# Altium project OBC.PrjPcb (part 1 of 2)
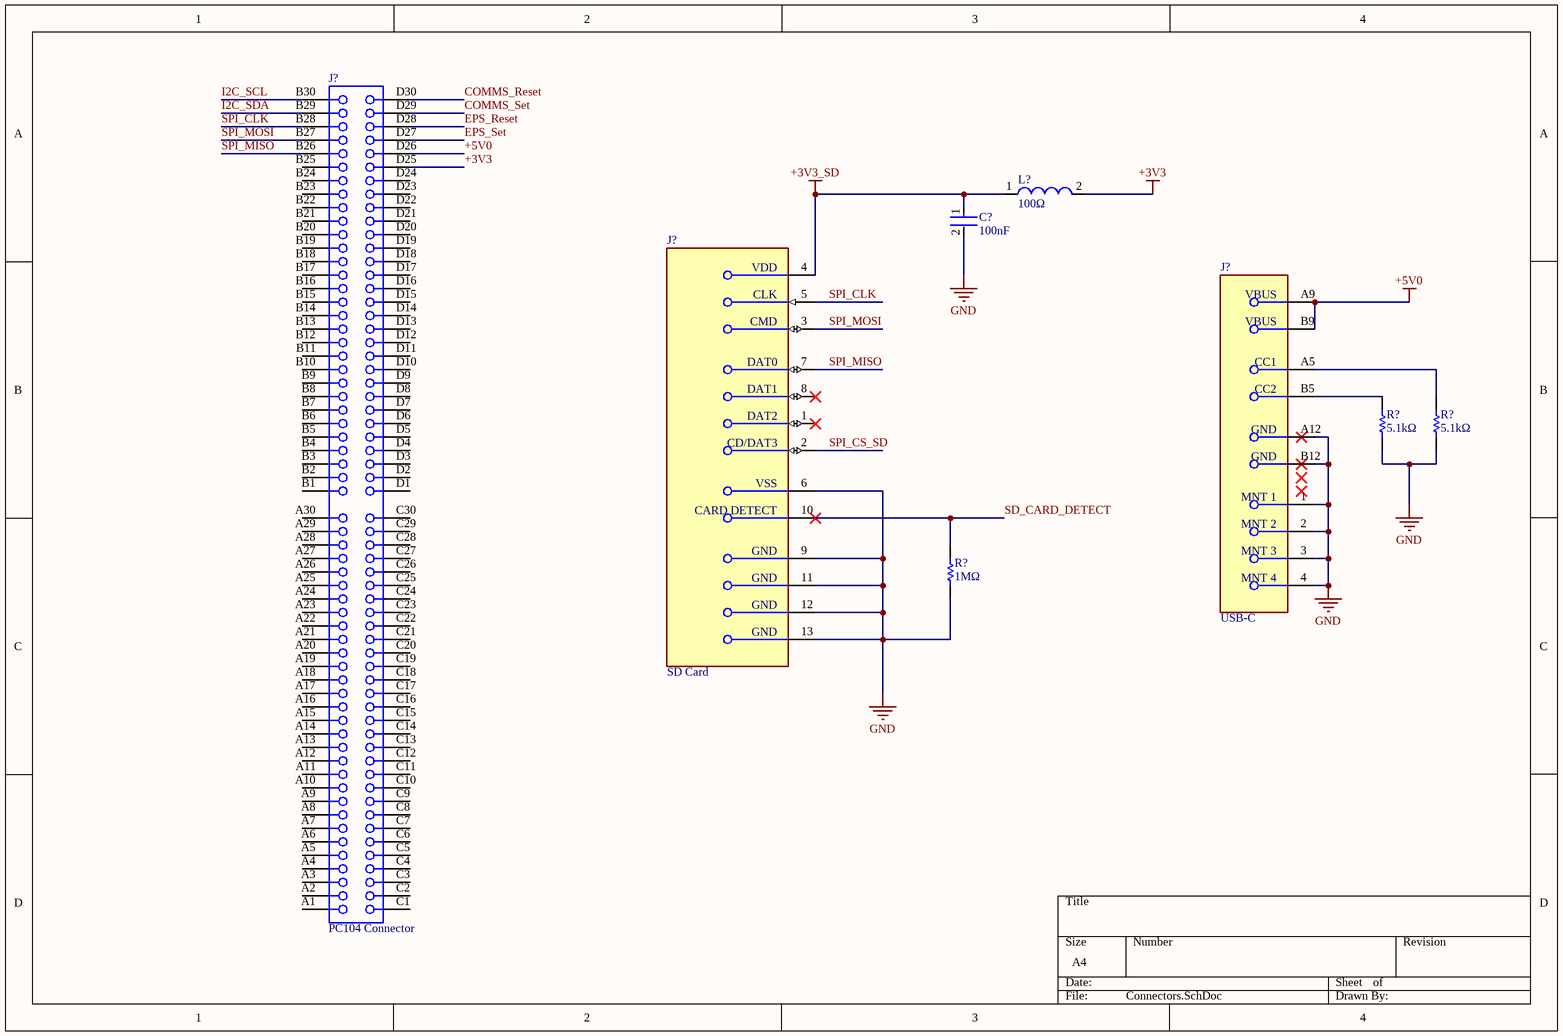
[diagram p0: Connectors.SchDoc]
CAGE_CODE: ?????; CONTRACT_NUMBER: <CONTRACT NO>; DOC_NO_ASSY_DWG: <ASSY DWG NO>; DOC_NO_BOM: <BOM DOC NO>; DOC_NO_FAB_DWG: <FAB DWG NO>; DOC_NO_SCH_DWG: <SCH DWG NO>; PCB_2_DEC_TOL: +/-.01; PCB_3_DEC_TOL: +/-.010; PCB_ANG_TOL: +/-1/2; PCB_ASSEMBLY_NO: <PCB ASSY NO>; PCB_CHECKER: - -----; PCB_CHECKER_APP_DATE: --/--/----; PCB_DESIGNER: - -----; PCB_DESIGNER_APP_DATE: --/--/----; PCB_DWG_NO: <PCB DWG NO>; PCB_ENGINEER: - -----; PCB_ENGINEER_APP_DATE: --/--/----; PCB_PART_NUMBER: <PCB PN>; PCB_REV: A; SCH_REV: A
8 sheets, 115 parts. Net scope: global (net labels, ports and power ports of the same name join across sheets).
Board file: PCB1.PcbDoc
Sheets:
  Connectors.SchDoc
  Sheet1.SchDoc
  Power.SchDoc
  Telemetry.SchDoc
  Microcontroller_Power.SchDoc
  Microcontroller_Interfacing.SchDoc
  Mounting_Holes.SchDoc
  Memory.SchDoc

## Sheet Connectors.SchDoc
size A4; SheetNumber: 1; SheetTotal: 7

### Parts
(Parts that share a designator on the sheet are numbered #1, #2 ... from top to bottom, then left to right.)
C?#1  100nF  [FP-CGA3E-0_3-0_1-IPC_A]
J?#1  SD Card  [FP-DM3CS-SF-MFG]
J?#2  USB-C  [FP-USB4125-GF-A-0190-MFG]
J?#3  PC104 Connector  [BTB2-V120F-04]
L?  100Ω  [SMD-0402]
R?#1  5.1kΩ  [RESC0603X26X15NL03T05]
R?#2  5.1kΩ  [RESC0603X26X15NL03T05]
R?#3  1MΩ  [RESC1005X40X25NL05T10]

### Nets
+3V3: J?#3.D25 L?.2
+3V3_SD: C?#1.1 J?#1.4(VDD) L?.1
+5V0: J?#2.A9(VBUS) J?#2.B9(VBUS) J?#3.D26
GND: C?#1.2 J?#1.6(VSS) J?#1.9(GND) J?#1.11(GND) J?#1.12(GND) J?#1.13(GND) J?#2.1(MNT_1) J?#2.2(MNT_2) J?#2.3(MNT_3) J?#2.4(MNT_4) J?#2.A12(GND) J?#2.B12(GND) R?#1.1 R?#2.1 R?#3.2
COMMS_Reset: J?#3.D30
COMMS_Set: J?#3.D29
EPS_Reset: J?#3.D28
EPS_Set: J?#3.D27
I2C_SCL: J?#3.B30
I2C_SDA: J?#3.B29
SD_CARD_DETECT: J?#1.10(CARD_DETECT) R?#3.1
SPI_CLK: J?#1.5(CLK) J?#3.B28
SPI_CS_SD: J?#1.2(CD/DAT3)
SPI_MISO: J?#1.7(DAT0) J?#3.B26
SPI_MOSI: J?#1.3(CMD) J?#3.B27
NetJ?#2_A5: J?#2.A5(CC1) R?#2.2
NetJ?#2_B5: J?#2.B5(CC2) R?#1.2

Not connected (* = marked no-connect by the designer): J?#1 1(DAT2)* 8(DAT1)*; J?#3 A1 A2 A3 A4 A5 A6 A7 A8 A9 A10 A11 A12 A13 A14 A15 A16 A17 A18 A19 A20 A21 A22 A23 A24 A25 A26 A27 A28 A29 A30 B1 B2 B3 B4 B5 B6 B7 B8 B9 B10 B11 B12 B13 B14 B15 B16 B17 B18 B19 B20 B21 B22 B23 B24 B25 C1 C2 C3 C4 C5 C6 C7 C8 C9 C10 C11 C12 C13 C14 C15 C16 C17 C18 C19 C20 C21 C22 C23 C24 C25 C26 C27 C28 C29 C30 D1 D2 D3 D4 D5 D6 D7 D8 D9 D10 D11 D12 D13 D14 D15 D16 D17 D18 D19 D20 D21 D22 D23 D24

### Library data of the parts
C?#1 = CMP-2000-07546-2: Cap Ceramic 100nF 50V X7R 10% Pad SMD 0603 +125°C Automotive T/R; Weight: 7.1E-05oz; Composition: Ceramic; Max Operating Temperature: 125°C; Termination: SMD/SMT; Dielectric: X7R; Length: 1.6mm; Package Quantity: 1; REACH SVHC: No SVHC; Lead Free: Lead Free; Case Code (Metric): 1608; Min Operating Temperature: -55°C; Packaging: Tape and Reel; Tolerance: 10%; Voltage Rating: 50V; Case Code (Imperial): 0603; Capacitance: 100nF; Case/Package: 0603; Voltage Rating (DC): 50V; Depth: 0.8mm; Radiation Hardening: No; Ratings: AEC-Q200; Mount: Surface Mount; Voltage: 50V; Thickness: 0.035inch; Width: 0.8mm; Height: 0.8mm
J?#1 = CMP-11597-000003-1: CONN MICRO SD CARD HINGED TYPE; Pitch: 1.1mm; Connector Type: Connector; Current Rating: 500mA; Voltage Rating (AC): 125V; Gender: Female; Insulation Resistance: 1GR; Number of Positions: 8; Contact Resistance: 100mR; Packaging: Tape and Reel; Flammability Rating: UL94 V-0; Lead Free: Lead Free; Min Operating Temperature: -25°C; Orientation: Right Angle; Width: 13.8mm; Number of Rows: 1; Housing Material: Polymer; Package Quantity: 1; Mount: Surface Mount; Max Current Rating: 500mA; Radiation Hardening: No; Max Operating Temperature: 85°C; Contact Plating: Gold; Depth: 1.83mm; Contact Material: Gold; Length: 14.1mm; Number of Contacts: 8; Termination: Solder
J?#2 = CMP-245163-000004-1: CONN RCPT TYPE C 6P SMD RA
J?#3 = CMP-0001-00103-1: Board-to-Board Connector, PCI104, Self-Nesting Socket, Stackthrough, Vertical, 4-Row, Pitch 2mm, 120-Position, Stack 15.24mm, Receptacle; Component Kind: Standard; ClassName: Board Template Connector; Package Reference: BTB2-V120F-04; Publisher: Altium
L? = CMP-0220-00104-1: SMD EMI Suppression Ferrite Bead WE-CBF, Z = 100 Ohm; Impedance: 100 Ohm; DatasheetVersion: ver 1, Jul-2009; PackageReference: SMD-0402; ComponentLink2URL: http://www.we-online.de/katalog/media/pdf/742792711.pdf; PackageVersion: 2009; PackageDescription: Chip Inductor, 2-Leads, Body 1.0 x 0.5 mm; ComponentLink1Description: Manufacturer Link; ComponentLink1URL: http://www.we-online.com; ComponentLink2Description: Datasheet
R?#1 R?#2 = CMP-2004-02525-1: Part Number: MCRE000157; Manufacturer: Multicomp
R?#3 = CMP-2002-07490-1: Manufacturer: Yageo / Phycomp; Part Number: RC0402FR-071ML

## Sheet Sheet1.SchDoc
size 431 x 279 mm; SheetNumber: 2; SheetTotal: 7; ENG_APP_DATE: --/--/--; DSN_APP_DATE: --/--/--; CHK_APP_DATE: --/--/--
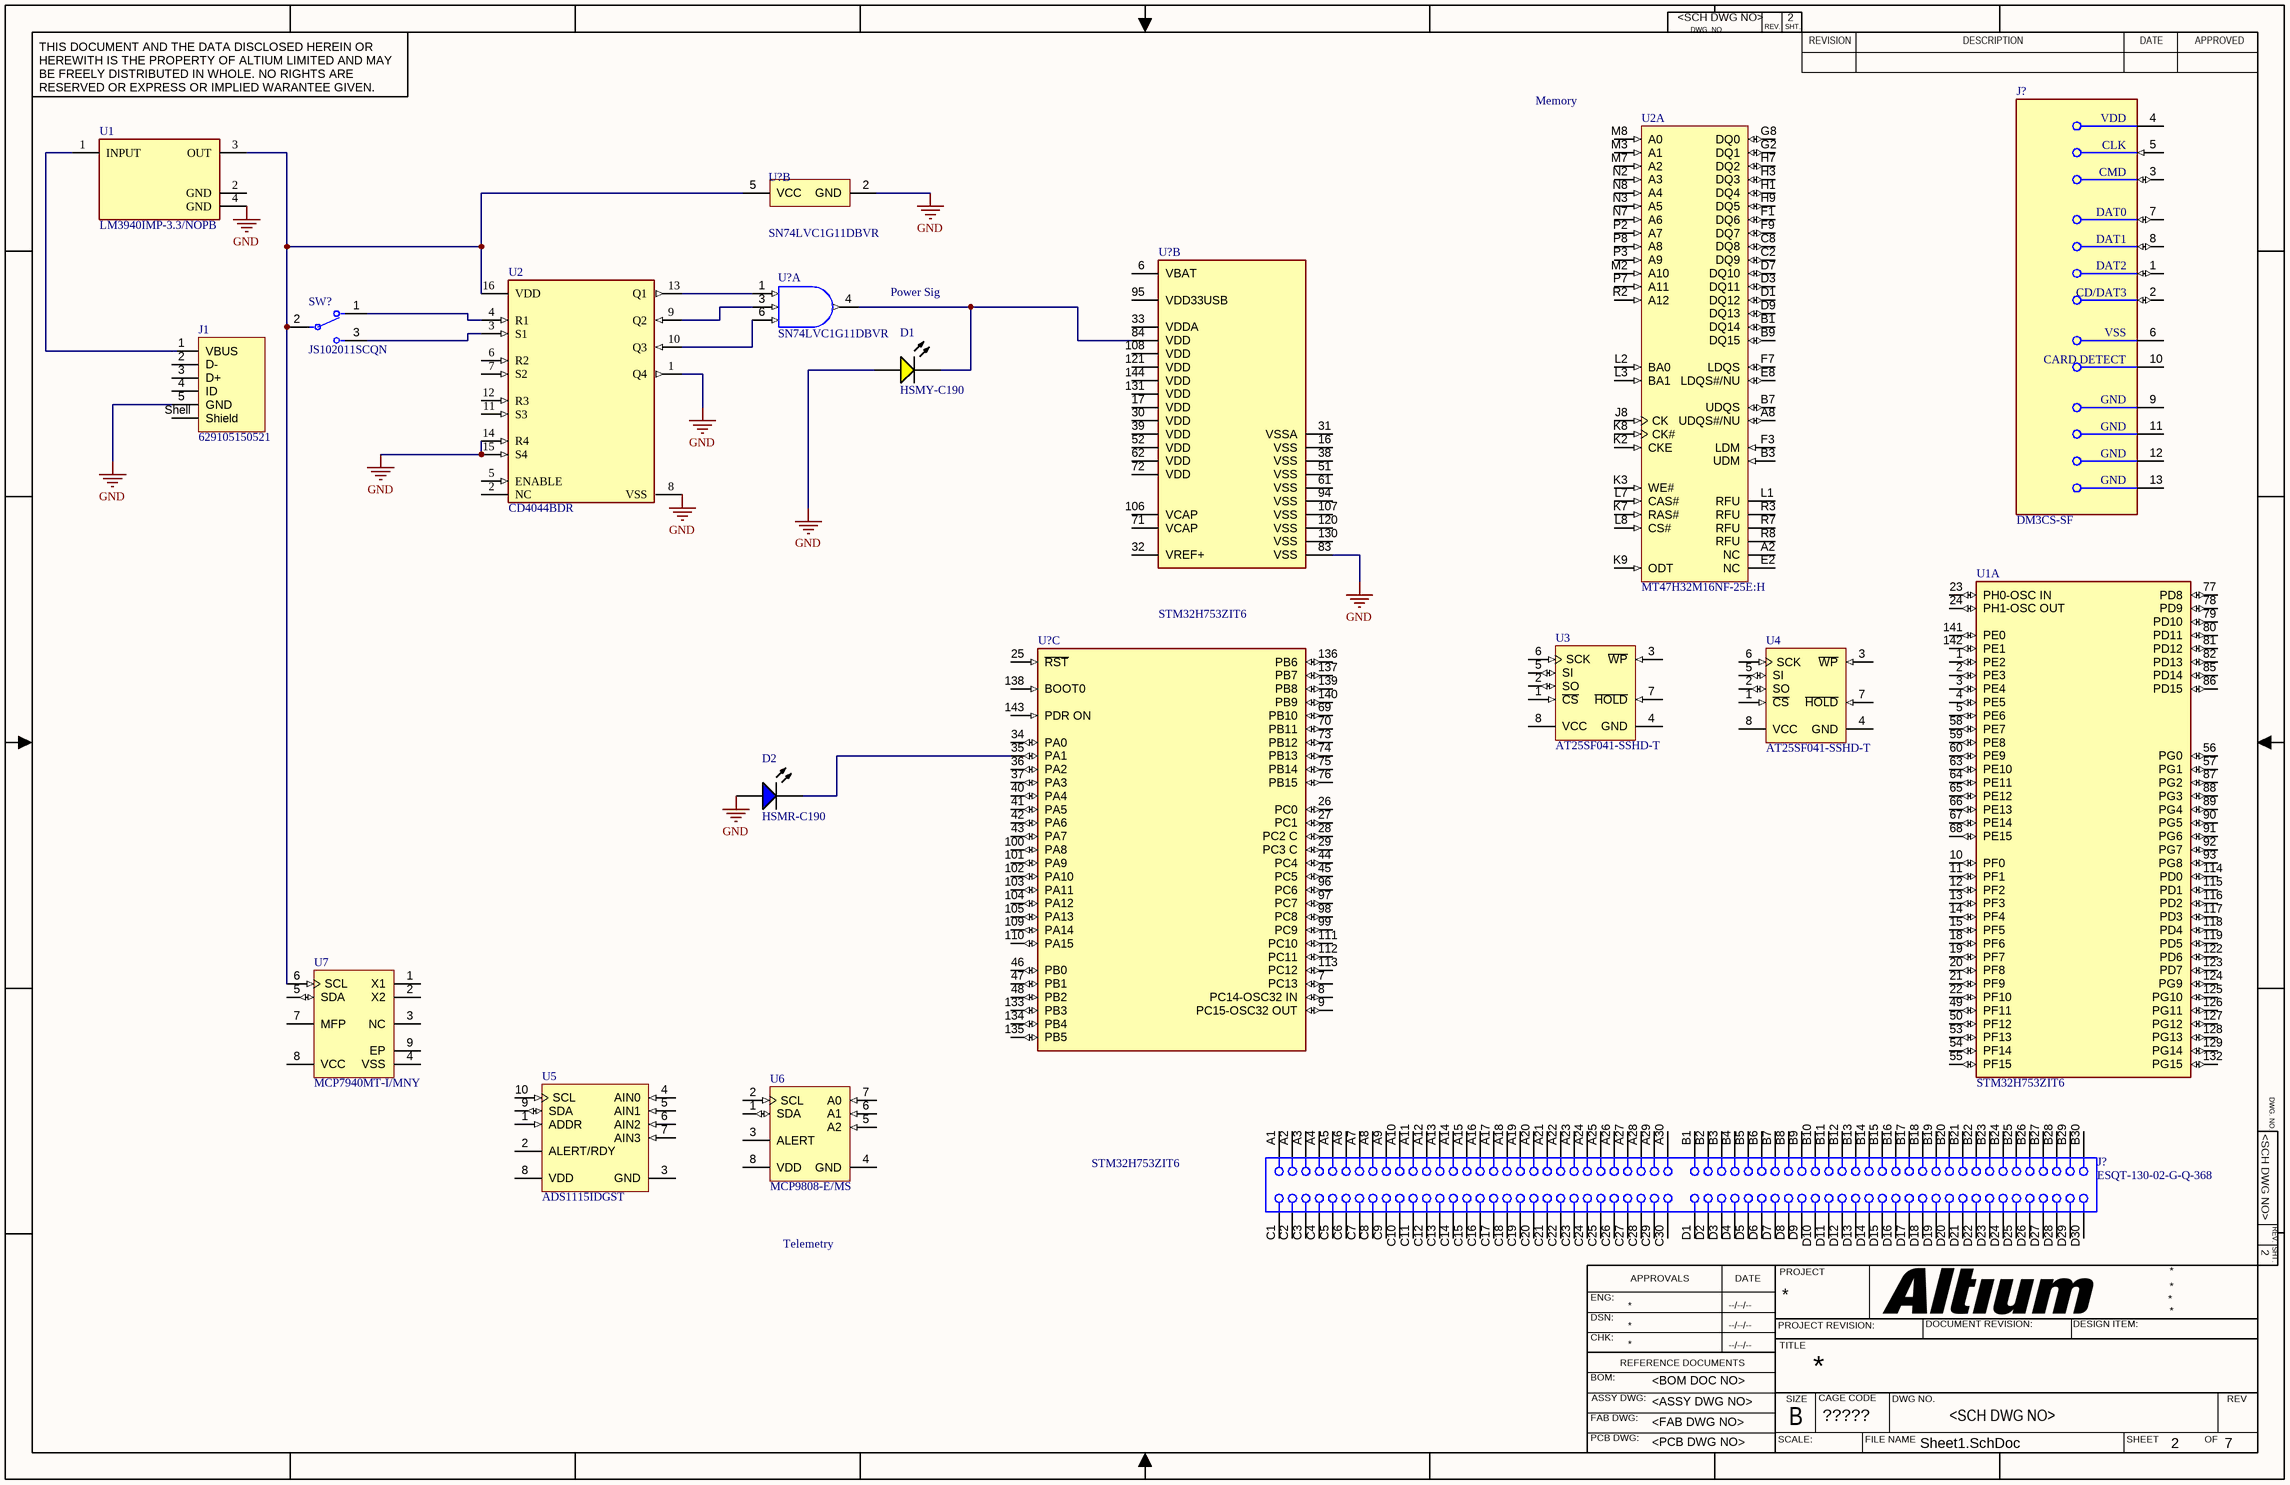
[diagram p1: Sheet1.SchDoc]

### Parts
(Parts that share a designator on the sheet are numbered #1, #2 ... from top to bottom, then left to right.)
D1  HSMY-C190  [AVAG-HSMX-C190_V]
D2  HSMR-C190  [AVAG-HSMX-C190_V]
J1  629105150521  [629105150521]
J?#4  DM3CS-SF  [FP-DM3CS-SF-MFG]
J?#5  ESQT-130-02-G-Q-368  [BTB2-V120F-04]
SW?#1  JS102011SCQN  [FP-JS102011SCQN-MFG]
U1#1  LM3940IMP-3.3/NOPB  [FP-DCY0004A-MFG]
U1#2  STM32H753ZIT6  [FP-LQFP144-1A-MFG]  (part A of 3)
U2#1  MT47H32M16NF-25E:H  [MICT-NF-84]  (part A of 2)
U2#2  CD4044BDR  [FP-D0016A-IPC_C]
U3  AT25SF041-SSHD-T  [ADST-SOIC-8_L]
U4  AT25SF041-SSHD-T  [ADST-SOIC-8_L]
U5  ADS1115IDGST  [TI-DGS10_M]
U6  MCP9808-E/MS  [MCHP-MSOP-MS8_L]
U7  MCP7940MT-I/MNY  [MCHP-TDFN-MNY8_V]
U?#1  SN74LVC1G11DBVR  [DBV0006A_N]  (part B of 2)
U?#2  STM32H753ZIT6  [FP-LQFP144-1A-MFG]  (part B of 3)
U?#3  SN74LVC1G11DBVR  [DBV0006A_N]  (part A of 2)
U?#4  STM32H753ZIT6  [FP-LQFP144-1A-MFG]  (part C of 3)

### Nets
GND: D1.1(A) D2.1(A) J1.5(GND) U1#1.4(GND) U2#2.1(Q4) U2#2.8(VSS) U2#2.14(R4) U2#2.15(S4) U?#1.2(GND) U?#2.83(VSS)
NetD1_2: D1.2(K) U?#2.84(VDD) U?#3.4(Y)
NetD2_2: D2.2(K) U?#4.35(PA1)
NetJ1_1: J1.1(VBUS) U1#1.1(INPUT)
NetSW?#1_1: SW?#1.1 U2#2.4(R1)
NetSW?#1_2: SW?#1.2(C) U1#1.3(OUT) U2#2.16(VDD) U7.6(SCL) U?#1.5(VCC)
NetSW?#1_3: SW?#1.3 U2#2.3(S1)
NetU2#2_9: U2#2.9(Q2) U?#3.3(B)
NetU2#2_10: U2#2.10(Q3) U?#3.6(C)
NetU2#2_13: U2#2.13(Q1) U?#3.1(A)

Not connected (* = marked no-connect by the designer): J1 2(D-) 3(D+) 4(ID) Shell(Shield); J?#4 1(DAT2) 2(CD/DAT3) 3(CMD) 4(VDD) 5(CLK) 6(VSS) 7(DAT0) 8(DAT1) 9(GND) 10(CARD_DETECT) 11(GND) 12(GND) 13(GND); J?#5 A1 A2 A3 A4 A5 A6 A7 A8 A9 A10 A11 A12 A13 A14 A15 A16 A17 A18 A19 A20 A21 A22 A23 A24 A25 A26 A27 A28 A29 A30 B1 B2 B3 B4 B5 B6 B7 B8 B9 B10 B11 B12 B13 B14 B15 B16 B17 B18 B19 B20 B21 B22 B23 B24 B25 B26 B27 B28 B29 B30 C1 C2 C3 C4 C5 C6 C7 C8 C9 C10 C11 C12 C13 C14 C15 C16 C17 C18 C19 C20 C21 C22 C23 C24 C25 C26 C27 C28 C29 C30 D1 D2 D3 D4 D5 D6 D7 D8 D9 D10 D11 D12 D13 D14 D15 D16 D17 D18 D19 D20 D21 D22 D23 D24 D25 D26 D27 D28 D29 D30; U1#1 2(GND); U1#2 1(PE2) 2(PE3) 3(PE4) 4(PE5) 5(PE6) 10(PF0) 11(PF1) 12(PF2) 13(PF3) 14(PF4) 15(PF5) 18(PF6) 19(PF7) 20(PF8) 21(PF9) 22(PF10) 23(PH0-OSC_IN) 24(PH1-OSC_OUT) 49(PF11) 50(PF12) 53(PF13) 54(PF14) 55(PF15) 56(PG0) 57(PG1) 58(PE7) 59(PE8) 60(PE9) 63(PE10) 64(PE11) 65(PE12) 66(PE13) 67(PE14) 68(PE15) 77(PD8) 78(PD9) 79(PD10) 80(PD11) 81(PD12) 82(PD13) 85(PD14) 86(PD15) 87(PG2) 88(PG3) 89(PG4) 90(PG5) 91(PG6) 92(PG7) 93(PG8) 114(PD0) 115(PD1) 116(PD2) 117(PD3) 118(PD4) 119(PD5) 122(PD6) 123(PD7) 124(PG9) 125(PG10) 126(PG11) 127(PG12) 128(PG13) 129(PG14) 132(PG15) 141(PE0) 142(PE1); U2#1 A2(NC) A8(UDQS#/NU) B1(DQ14) B3(UDM) B7(UDQS) B9(DQ15) C2(DQ9) C8(DQ8) D1(DQ12) D3(DQ11) D7(DQ10) D9(DQ13) E2(NC) E8(LDQS#/NU) F1(DQ6) F3(LDM) F7(LDQS) F9(DQ7) G2(DQ1) G8(DQ0) H1(DQ4) H3(DQ3) H7(DQ2) H9(DQ5) J8(CK) K2(CKE) K3(WE#) K7(RAS#) K8(CK#) K9(ODT) L1(RFU) L2(BA0) L3(BA1) L7(CAS#) L8(CS#) M2(A10) M3(A1) M7(A2) M8(A0) N2(A3) N3(A5) N7(A6) N8(A4) P2(A7) P3(A9) P7(A11) P8(A8) R2(A12) R3(RFU) R7(RFU) R8(RFU); U2#2 2(NC) 5(ENABLE) 6(R2) 7(S2) 11(S3) 12(R3); U3 1(~{CS}) 2(SO) 3(~{WP}) 4(GND) 5(SI) 6(SCK) 7(~{HOLD}) 8(VCC); U4 1(~{CS}) 2(SO) 3(~{WP}) 4(GND) 5(SI) 6(SCK) 7(~{HOLD}) 8(VCC); U5 1(ADDR) 2(ALERT/RDY) 3(GND) 4(AIN0) 5(AIN1) 6(AIN2) 7(AIN3) 8(VDD) 9(SDA) 10(SCL); U6 1(SDA) 2(SCL) 3(ALERT) 4(GND) 5(A2) 6(A1) 7(A0) 8(VDD); U7 1(X1) 2(X2) 3(NC) 4(VSS) 5(SDA) 7(MFP) 8(VCC) 9(EP); U?#2 6(VBAT) 16(VSS) 17(VDD) 30(VDD) 31(VSSA) 32(VREF+) 33(VDDA) 38(VSS) 39(VDD) 51(VSS) 52(VDD) 61(VSS) 62(VDD) 71(VCAP) 72(VDD) 94(VSS) 95(VDD33USB) 106(VCAP) 107(VSS) 108(VDD) 120(VSS) 121(VDD) 130(VSS) 131(VDD) 144(VDD); U?#4 7(PC13) 8(PC14-OSC32_IN) 9(PC15-OSC32_OUT) 25(~{RST}) 26(PC0) 27(PC1) 28(PC2_C) 29(PC3_C) 34(PA0) 36(PA2) 37(PA3) 40(PA4) 41(PA5) 42(PA6) 43(PA7) 44(PC4) 45(PC5) 46(PB0) 47(PB1) 48(PB2) 69(PB10) 70(PB11) 73(PB12) 74(PB13) 75(PB14) 76(PB15) 96(PC6) 97(PC7) 98(PC8) 99(PC9) 100(PA8) 101(PA9) 102(PA10) 103(PA11) 104(PA12) 105(PA13) 109(PA14) 110(PA15) 111(PC10) 112(PC11) 113(PC12) 133(PB3) 134(PB4) 135(PB5) 136(PB6) 137(PB7) 138(BOOT0) 139(PB8) 140(PB9) 143(PDR_ON)

### Notes on the sheet
- Memory
- Power Sig
- Telemetry
- DWG. NO.
- REV.
- SHT.
- THIS DOCUMENT AND THE DATA DISCLOSED HEREIN OR HEREWITH IS THE PROPERTY OF ALTIUM LIMITED AND MAY BE FREELY DISTRIBUTED IN WHOLE. NO RIGHTS ARE RESERVED OR EXPRESS OR IMPLIED WARANTEE GIVEN.
- REVISION
- DESCRIPTION
- DATE
- APPROVED
- ENG:
- APPROVALS
- PROJECT
- DSN:
- CHK:
- REFERENCE DOCUMENTS
- PROJECT REVISION:
- TITLE
- DOCUMENT REVISION:
- DESIGN ITEM:
- BOM:
- FAB DWG:
- PCB DWG:
- ASSY DWG:
- SCALE:
- SIZE
- B
- CAGE CODE
- FILE NAME
- DWG NO.
- SHEET
- OF
- REV

### Library data of the parts
D1 = CMP-1744-00003-1: LED Uni-Color Yellow, 65 mW, 20 mA, -40 to 85 degC, 2-Pin SMD, RoHS, Tape and Reel; Tolerance: 1%; Voltage Rating: 50 V; Power Rating: 100 mW; Case\Package: 0603; Resistance: 390 Ohm; Min Operating Temperature: -55 degC; Length: 1.6 mm; ComponentLink3Description: Package Specification; Mount: Surface Mount; PackageReference: HSMX-C190; ComponentLink2Description: Datasheet; DatasheetVersion: Mar-12; Case Code (Metric): 1608; Pins: 2; Package Quantity: 5000; ComponentLink2URL: http://docs.avagotech.com/docs/AV02-0551EN; ComponentLink1Description: Manufacturer URL; RoHSCompliant: true; Packaging: Tape and Reel; PackageDescription: 2-Pin Surface Mount Device, Body 1.6 x 0.8 mm, Height 0.9 mm; REACH SVHC: No SVHC; ComponentLink3URL: http://www.fairchildsemi.com/dwg/MA/MA03D.pdf; Voltage Rating (DC): 50 V; Width: 0.8 mm; ComponentLink1URL: http://www.avagotech.com/; Max Operating Temperature: 155 degC; Case Code (Imperial): 0603; Height: 0.45 mm
D2 = CMP-1744-00007-1: LED Uni-Color Blue, 78 mW, 20 mA, -40 to 85 degC, 2-Pin SMD, RoHS, Tape and Reel; Rds On Max: 10 Ohm; Nominal Vgs: -1.7 V; Max Power Dissipation: 360 mW; Elements: 1; Case\Package: TO-236-3; Input Capacitance: 73 pF; Typical Rise Time: 6.3 ns; Nominal Dual Supply Voltage: -50 V; Packaging: Tape and Reel; Height: 0.93 mm; Mount: Surface Mount; RoHSCompliant: true; DatasheetVersion: Apr-10; REACH SVHC: No SVHC; ComponentLink1URL: http://www.avagotech.com/; Radiation Hardening: No; ComponentLink3Description: Package Specification; ComponentLink3URL: http://www.fairchildsemi.com/dwg/MA/MA03D.pdf; ComponentLink2Description: Datasheet; PackageDescription: 2-Pin Surface Mount Device, Body 1.6 x 0.8 mm, Height 0.9 mm; Package Quantity: 3000; PackageReference: HSMX-C190; ComponentLink1Description: Manufacturer URL; Pins: 3; Length: 2.92 mm; ComponentLink2URL: http://docs.avagotech.com/docs/AV02-0977EN; Min Operating Temperature: -55 degC; Width: 1.3 mm; Max Operating Temperature: 150 degC
J1 = CMP-1502-03252-3: NexarPartId: 52645113; Number of Contacts: 5; Contact Resistance: 30mΩ; Connector Type: USB; Voltage Rating: 30V; Current Rating: 3A; USB Standard: USB 2.0; Gender: Receptacle; Insulation Resistance: 1GΩ; Height: 2.86mm; REACH SVHC: Unknown; RoHS: Compliant; Features: Shielded; Termination: SMD/SMT; Number of Pins: 5; Contact Plating: Gold; Packaging: Tape and Reel; Contact Material: Gold; Mount: Horizontal, Surface Mount; Max Operating Temperature: 85°C; Lead Free: Lead Free; Min Operating Temperature: -40°C; Orientation: Horizontal; Operating Supply Voltage: 30V
J?#4 = CMP-11597-000003-1: as J?#1 on sheet Connectors; Packaging: Tape and Reel; Flammability Rating: UL94 V-0; Lead Free: Lead Free; Min Operating Temperature: -25°C; Orientation: Right Angle; Width: 13.8mm; Number of Rows: 1; Housing Material: Polymer; Package Quantity: 1; Mount: Surface Mount; Max Current Rating: 500mA; Radiation Hardening: No; Max Operating Temperature: 85°C; Contact Plating: Gold; Depth: 1.83mm; Contact Material: Gold; Length: 14.1mm; Number of Contacts: 8; Termination: Solder
J?#5 = CMP-0001-00103-1: as J?#3 on sheet Connectors; Component Kind: Standard; ClassName: Board Template Connector; Package Reference: BTB2-V120F-04; Publisher: Altium
SW?#1 = CMP-10038-000023-1: SWITCH SLIDE SPDT 300MA 6V; Electrical Life: 5000Cycles; Actuator Type: Standard; Contact Resistance: 70mR; Actuator Material: Nylon; Max Voltage Rating (DC): 30V; Actuator Length: 2mm; Switch Function: On-On; Actuator Color: Black; Radiation Hardening: No; Throw Configuration: SPDT; Depth: 7.5mm; Case/Package: SMD/SMT; Package Quantity: 4000; Min Operating Temperature: -40°C; Length: 8.5mm; Current Rating: 300mA; Mount: Surface Mount; Voltage Rating (DC): 6V; RoHS Compliant: Yes; Orientation: Straight; Housing Material: Nylon; Contact Plating: Silver; Max Operating Temperature: 85°C; Packaging: Tape and Reel; Switch Travel: 2mm; Max Current Rating: 300mA; Contact Material: Copper Alloy; Series: JS; Termination: Gull Wing
U1#1 = CMP-0062-01788-4: IC REG LINEAR 3.3V 1A SOT223-4; Min Input Voltage: 4.5V; Max Supply Voltage: 7.5V; Number of Outputs: 1; Output Type: Fixed; Polarity: Positive; Dropout Voltage: 500mV; Quiescent Current: 15mA; Max Output Voltage: 3.3V; Length: 6.5mm; Termination: SMD/SMT; Width: 3.56mm; Min Supply Voltage: 4.5V; Max Output Current: 1A; Case/Package: SOT-223; Output Voltage: 3.3V; Current Rating: 1A; Packaging: Tape and Reel; Lead Free: Lead Free; Nominal Output Voltage: 3.3V; Height: 1.6mm; Series: -; Output Configuration: Positive; Radiation Hardening: No; Number of Regulators: 1; Package Quantity: 1000; REACH SVHC: No SVHC; Max Input Voltage: 7.5V; Max Operating Temperature: 125°C; Min Operating Temperature: -40°C; Output Current: 1A; Contact Plating: Tin; Number of Pins: 4; Mount: Surface Mount
U1#2 U?#2 U?#4 = CMP-12105-000009-1: LQFP 144 20X20X1.4 2; Manufacturer: STMicroelectronics; Number Of Pwm Channels: 24; Number Of I/Os: 114; Number Of Cores: 1; Min Supply Voltage: 1.62V; Interface: I2C,SPI,UART,USART,CAN,USB,LIN,IrDA,Ethernet,I2S,SMBus,Other; Standoff Height: 0.05mm; Number Of I2C Channels: 4; Max Junction Temp: +125°C; Memory Type: FLASH; Ram Size: 1MBytes; Number Of Spi Channels: 6; Core Architecture: ARM Cortex-M7; Number Of Uart Channels: 9; Memory Size: 2MBytes; Number Of Adc Channels: 36; Frequency: 480MHz; Data Bus Width: 32bits; Max Supply Voltage: 3.6V; Number Of Usb Channels: 2; Number Of A/D Converters: 3; Number Of Timers/Counters: 20; Temperature Range High: +125°C; Automotive: No; Mouser Description: MCU 32-Bit STM32 ARM Cortex M7 RISC 2MB Flash 1.8V/2.5V/3.3V 144-Pin LQFP Tray; Device Class L3: Microcontrollers; Height: 1.6mm; Octopart: https://octopart.com/stm32h753zit6-stmicroelectronics-87879771; Device Class L2: Embedded Processors and Controllers; Lead Free: Yes; Category: IC; ComponentLink2URL: https://www.st.com/resource/en/datasheet/stm32h753zi.pdf; Ambient Temperature Range High: +85°C; Number Of Ethernet Channels: 1; Device Class L1: Integrated Circuits (ICs); Ambient Temperature Range Low: -40°C; Package: LQFP144-1A; Temperature Range Low: -40°C; Digikey Description: LQFP 144 20X20X1.4 2; ComponentLink2Description: Datasheet; Temperature: -40°C to +125°C; Manufacturer Part Number: STM32H753ZIT6; RoHS: TRUE
U2#1 = CMP-2000-05228-1: 512 Mb DDR2-800 SDRAM, 32 Mb x 16, 2.5 ns, 1.8 V, 0 to 85 degC, 84-Ball FBGA, RoHS, Bulk; Manufacturer: Micron; Density: 512Mb; Number of I/O Lines: 16Bit; Maximum Clock Rate: 400MHz; Maximum Random Access Time: 0.4ns; Organization: 32Mx16; Screening Level: Commercial; Address Bus Width: 13Bit; Operating Supply Voltage: 1.8V; Lead Finish: Tin; Max Processing Temp: 260; Package Description: 84-Ball Ball Grid Array, Body 12.5 x 8 mm, Pitch 0.8 mm; Mounting: SurfaceMount; Datasheet URL: https://ciiva.com/datasheet-click-29613630?src=ciiva&sig=42c75271; Package Reference: NF84; Number of Bits per Word: 16Bit; Datasheet Version: Rev. W, 04/2014; Operating Temperature: 0to85C; Manufacturer URL: https://www.micron.com/; Type: DDR2SDRAM; Data Bus Width: 16Bit
U2#2 = CMP-04902-000018-1: IC QUAD NAND R/S LATCH 16SOIC; Polarity: Non-Inverting; Min Supply Voltage: 3V; Number of Output Lines: 4; Output Type: 3-STATE; Max Supply Voltage: 18V; Turn-On Delay Time: 50ns; Number of Elements: 1; Number of Input Lines: 8; Output Current: 6.8mA; High Level Output Current: -4.2mA; Low Level Output Current: 4.2mA; Quiescent Current: 20uA; Propagation Delay: 300ns; Mount: Surface Mount; Packaging: Tape and Reel; Weight: 0.004998oz; Contact Plating: Gold; Independent Circuits: 4; Number of Pins: 16; Number of Bits: 4; Max Operating Temperature: 125°C; Radiation Hardening: No; Case/Package: SOIC; Number of Circuits: 1; Technology: CMOS; Min Operating Temperature: -55°C; Package Quantity: 1; Lead Free: Lead Free; RoHS Compliant: Yes; Logic Function: Latch; Series: 4000B
U3 U4 = CMP-2000-07560-1: SPI Serial Flash Memory with Dual-I/O and Quad-I/O Support, 4 Mbits, 2.5 to 3.6 V, -40 to 85 degC, 8-Pin SOIC, RoHS, Tape and Reel; Manufacturer: Adesto; Frequency: 104MHz; Access Time: 8ns; Data Bus Width: 8b; Min Supply Voltage: 2.5V; Operating Supply Voltage: 3.3V; Package Version: Rev. G, 08/2014; Density: 4Mb; Page Size: 256B; Max Supply Voltage: 3.6V; Max Supply Current: 8mA; Number of Pins: 8; Memory Type: FLASH; Manufacturer URL: http://www.adestotech.com/; Max Frequency: 104MHz; Interface: Serial; Package Quantity: 4000; Weight: 0.019048oz; Mounting Technology: SurfaceMount; Min Operating Temperature: -40degC; Package Reference: SOIC-8; Max Operating Temperature: 85degC; Lead Free: LeadFree; Mount: SurfaceMount; Contact Plating: Gold; RoHSCompliant: True; Package Description: 8-Pin Small Outline Integrated Circuit, Body 4.925 x 3.9 mm, Pitch 1.27 mm; Case\/Package: SOIC; Datasheet URL: http://www.adestotech.com/wp-content/uploads/DS-AT25SF041_044.pdf; Datasheet Version: Rev. G, 08/2017; Memory Size: 4Mb; Packaging: TapeandReel
U5 = CMP-0003-00378-2: 16-Bit ADC with Integrated Multiplexer, PGA, Comparator, Oscillator, and Reference, -40 to 125 degC, 10-pin SOP (DGS10), Green (RoHS & no Sb/Br); Manufacturer: Texas Instruments; Sample Rate (max)(SPS): 860; SubFamily: Precision ADC (<=10MSPS); Architecture: Delta-Sigma; Digital Supply(Min)(V): 2; Resolution(Bits): 16; Digital Supply(Max)(V): 5.5; INL(Max)(+/-LSB): 1; Interface: Serial I2C; # Input Channels: 4; Eco-Plan: Green (RoHS & no Sb/Br); PackageDescription: 10-Pin Plastic Small Outline, Body 3 x 3 mm, Pitch 0.5 mm; Mounting Technology: Surface Mount; PackageReference: DGS10; DatasheetVersion: SBAS444B; ComponentLink3Description: Package Specification; ComponentLink1Description: Manufacturer URL; PartNumber: ADS1115IDGST; ComponentLink3URL: http://www.ti.com/lit/ml/mpds035b/mpds035b.pdf; ComponentLink2URL: http://www.ti.com/general/docs/lit/getliterature.tsp?genericPartNumber=ADS1115&fileType=pdf; Analog Voltage AV/DD(Min)(V): 2; ComponentLink2Description: Datasheet; PackageVersion: 4073272/C, 02/2004; Analog Voltage AV/DD(Max)(V): 5.5; Code_JEDEC: MO-153; ComponentLink1URL: http://www.ti.com/
U6 = CMP-0192-00344-1: + / - 0.5 degC Maximum Accuracy Digital Temperature Sensor, 400 uA, 2.7 to 5.5 V, -40 to 125 degC, 8-pin MSOP (MS8), Tube; Manufacturer: Microchip; ComponentLink3Description: Package Specification; ComponentLink4URL: http://www.microchip.com/MCP9808; PackageDescription: 8-Lead Plastic Micro Small Outline Package, 3 x 3 mm Body, 0.65 mm Pitch; ComponentLink2Description: Datasheet; PartNumber: MCP9808-E/MS; Mounting Technology: Surface Mount; ComponentLink4Description: Product URL; ComponentLink1Description: Manufacturer URL; ComponentLink2URL: http://ww1.microchip.com/downloads/en/DeviceDoc/25095A.pdf; ComponentLink3URL: http://www.microchip.com/stellent/groups/techpub_sg/documents/packagingspec/en012702.pdf; DatasheetVersion: Rev. A; ComponentLink1URL: http://www.microchip.com; PackageReference: MSOP-MS8; PackageVersion: C04-111C
U7 = CMP-0186-00324-1: Low-Cost I2C™ Real-Time Clock / Calendar with SRAM, 400 KHz Communications Speed, 64 Bytes SRAM, -40 to 85 degC, 8-pin TDFN (MNY8), Tape and Reel; Manufacturer: Microchip; ComponentLink2URL: http://ww1.microchip.com/downloads/en/DeviceDoc/22292A.pdf; ComponentLink3Description: Package Specification; Mounting Technology: Surface Mount; PackageVersion: C04-129C; ComponentLink4URL: http://www.microchip.com/MCP7940M; DatasheetVersion: Rev. A; PackageReference: TDFN-MNY8; PartNumber: MCP7940MT-I/MNY; ComponentLink4Description: Product URL; ComponentLink2Description: Datasheet; ComponentLink3URL: http://www.microchip.com/stellent/groups/techpub_sg/documents/packagingspec/en012702.pdf; PackageDescription: 8-Lead Plastic Dual Flat, 2 x 3 mm Body, 0.5 mm Pitch; ComponentLink1Description: Manufacturer URL; ComponentLink1URL: http://www.microchip.com
U?#1 U?#3 = CMP-0859-00236-3: Single 3-Input Positive-AND Gate, DBV0006A, LARGE T&R; Manufacturer: Texas Instruments; Output Type: CMOS; Voltage(Nom)(V): 1.8,2.5,3.3,5; ICC @ Nom Voltage(Max)(mA): 0.01; VCC(Min)(V): 1.65; Output Drive (IOL/IOH)(Max)(mA): 32/-32; Schmitt Trigger: No; Input Type: CMOS/TTL; VCC(Max)(V): 5.5; Gate Type: AND; Rating: Catalog; tpd @ Nom Voltage(Max)(ns): 20,7.8,6.2,4.6; Bits(#): 1; F @ Nom Voltage(Max)(Mhz): 150; Logic: True; Technology Family: LVC; Sub-Family: AND Gate; PackageReference: DBV0006A; Operating Temperature Range(C): -40 to 125,-40 to 85; DatasheetVersion: SCES487F; 3-State Output: No; Generic Part Number: SN74LVC1G11

## Sheet Power.SchDoc
size A4; SheetNumber: 3; SheetTotal: 7
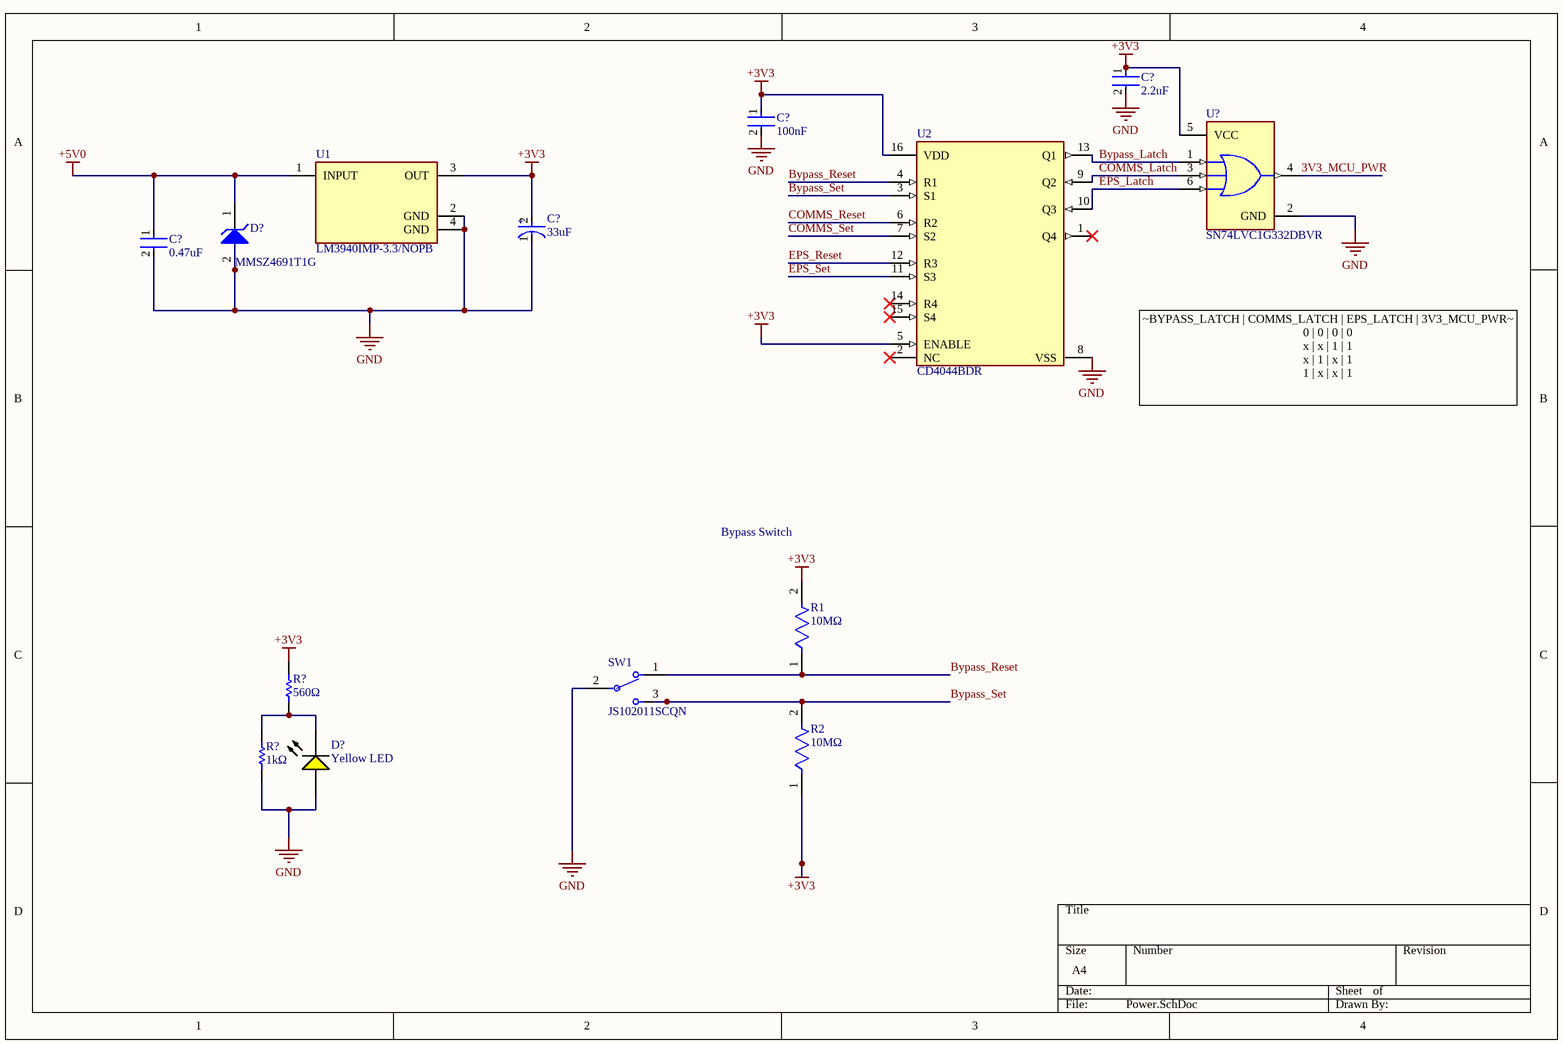
[diagram p2: Power.SchDoc]

### Parts
(Parts that share a designator on the sheet are numbered #1, #2 ... from top to bottom, then left to right.)
C?#2  2.2uF  [FP-GRM188-0_1-e0_2_0_5-MFG]
C?#3  100nF  [FP-CGA3E-0_3-0_1-IPC_A]
C?#4  33uF  [FP-TPSD-MFG]
C?#5  0.47uF  [FP-GRM188-0_1-e0_2_0_5-IPC_B]
D?#1  MMSZ4691T1G  [ONSC-SOD-123-2-425-04_V]
D?#2  Yellow LED  [AVAG-HSMX-C190_V]
R1  10MΩ  [FP-ERJ3EK-IPC_C]
R2  10MΩ  [FP-ERJ3EK-IPC_C]
R?#4  560Ω  [RESC1608X55X30ML15T15]
R?#5  1kΩ  [RESC2013X60X35ML10T20]
SW1  JS102011SCQN  [FP-JS102011SCQN-MFG]
U1#3  LM3940IMP-3.3/NOPB  [FP-DCY0004A-MFG]
U2#3  CD4044BDR  [FP-D0016A-IPC_C]
U?#5  SN74LVC1G332DBVR  [FP-DBV0006A-MFG]

### Nets
+3V3: C?#2.1 C?#3.1 C?#4.2(A) R1.2 R2.1 R?#4.2 U1#3.3(OUT) U2#3.5(ENABLE) U2#3.16(VDD) U?#5.5(VCC)
+5V0: C?#5.1 D?#1.1(K) U1#3.1(INPUT)
GND: C?#2.2 C?#3.2 C?#4.1(C) C?#5.2 D?#1.2(A) D?#2.1(A) R?#5.1 SW1.2(C) U1#3.2(GND) U1#3.4(GND) U2#3.8(VSS) U?#5.2(GND)
3V3_MCU_PWR: U?#5.4(Y)
Bypass_Latch: U2#3.13(Q1) U?#5.1(A)
Bypass_Reset: R1.1 SW1.1 U2#3.4(R1)
Bypass_Set: R2.2 SW1.3 U2#3.3(S1)
COMMS_Latch: U2#3.9(Q2) U?#5.3(B)
COMMS_Reset: U2#3.6(R2)
COMMS_Set: U2#3.7(S2)
EPS_Latch: U2#3.10(Q3) U?#5.6(C)
EPS_Reset: U2#3.12(R3)
EPS_Set: U2#3.11(S3)
NetD?#2_2: D?#2.2(K) R?#4.1 R?#5.2

Not connected (* = marked no-connect by the designer): U2#3 1(Q4)* 2(NC)* 14(R4)* 15(S4)*

### Notes on the sheet
- ~BYPASS_LATCH | COMMS_LATCH | EPS_LATCH | 3V3_MCU_PWR~
  0 | 0 | 0 | 0
  x | x | 1 | 1
  x | 1 | x | 1
  1 | x | x | 1
- Bypass Switch
- (in symbol CMP-2000-07304-2) +

### Library data of the parts
C?#2 = CMP-2006-02836-2: Chip Multilayer Ceramic Capacitors for General Purpose, 0603, 2.2uF, X7R, 15%, 10%, 10V; Case Code (Metric): 1608; Height: 0.8mm; Packaging: Cut Tape; Voltage: 10V; Lead Free: Lead Free; Min Operating Temperature: -55°C; Voltage Rating (DC): 10V; Max Operating Temperature: 125°C; Voltage Rating: 10V; Dielectric: X7R; Depth: 0.8mm; Case Code (Imperial): 0603; Termination: SMD/SMT; Case/Package: 0603; Number of Pins: 2; REACH SVHC: No SVHC; Mount: Surface Mount; Width: 0.031inch; Material: Ceramic; Capacitance: 2.2uF; Package Quantity: 1; Weight: 7.1E-05oz; Length: 1.6mm; Thickness: 0.035inch; Tolerance: 10%
C?#3 = CMP-2000-07546-2: as C?#1 on sheet Connectors; Weight: 7.1E-05oz; Composition: Ceramic; Max Operating Temperature: 125°C; Termination: SMD/SMT; Dielectric: X7R; Length: 1.6mm; Package Quantity: 1; REACH SVHC: No SVHC; Lead Free: Lead Free; Case Code (Metric): 1608; Min Operating Temperature: -55°C; Packaging: Tape and Reel; Tolerance: 10%; Voltage Rating: 50V; Case Code (Imperial): 0603; Capacitance: 100nF; Case/Package: 0603; Voltage Rating (DC): 50V; Depth: 0.8mm; Radiation Hardening: No; Ratings: AEC-Q200; Mount: Surface Mount; Voltage: 50V; Thickness: 0.035inch; Width: 0.8mm; Height: 0.8mm
C?#4 = CMP-2000-07304-2: CAP TANT 33UF 10% 35V 2917; Leakage Current: 11.6uA; Polarity: Polar; Ripple Current: 283uA; Dielectric Material: Tantalum; Dissipation Factor: 6%; ESR (Equivalent Series Resistance): 300mR; Number of Pins: 2; Series: TPS; Features: General Purpose; Capacitance: 33uF; Voltage Rating: 35V; Case Code (Imperial): 2917; Voltage Rating (DC): 35V; Min Operating Temperature: -55°C; Termination: SMD/SMT; REACH SVHC: No SVHC; Tolerance: 10%; Height - Seated (Max): 0.122inch; Height: 2.9mm; Package Quantity: 1; Case Code (Metric): 7343; RoHS Compliant: Yes; Voltage: 35V; Mount: Surface Mount; Weight: 0.023634oz; Packaging: Tape and Reel; Construction: Flat; Lead Free: Lead Free; Size: 2.9mm; Depth: 4.3mm; Case/Package: 2917; Radiation Hardening: No; Max Operating Temperature: 125°C; Length: 7.3mm; Width: 4.3mm
C?#5 = CMP-2006-02860-2: Chip Multilayer Ceramic Capacitors for General Purpose, 0603, 0.47uF, X7R, 15%, 10%, 16V; Capacitance: 470nF; Material: Ceramic; Termination: SMD/SMT; Case Code (Imperial): 0603; Height: 0.8mm; Dielectric: X7R; Length: 1.6mm; Packaging: Tape and Reel; Mount: Surface Mount; Thickness: 0.035inch; Voltage Rating (DC): 16V; Case Code (Metric): 1608; REACH SVHC: No SVHC; Depth: 0.8mm; Number of Pins: 2; Max Operating Temperature: 125°C; Min Operating Temperature: -55°C; Width: 0.8mm; Voltage: 16V; Lead Free: Lead Free; Voltage Rating: 16V; Package Quantity: 1; Case/Package: 0603; Tolerance: 10%
D?#1 = CMP-1060-00606-1: Zener Voltage Regulator, 500 mW, 2-Pin SOD-123, Pb-Free, Tape and Reel; Manufacturer: On Semiconductor; VZ Typ (V): 6.2; P Max (W): 0.5; DatasheetVersion: Rev. 9; ComponentLink1Description: Manufacturer URL; PackageReference: SOD-123-2-425-04; PartNumber: MMSZ4691T1G; RoHS: Pb-Free; Mounting Technology: Surface Mount; ComponentLink3URL: http://www.onsemi.com/pub_link/Collateral/425-04.PDF; Packing: Tape and Reel; ComponentLink2URL: http://www.onsemi.com/pub_link/Collateral/MMSZ4678T1-D.PDF; PackageVersion: Rev. G, 10/2009; ComponentLink1URL: http://www.onsemi.com/; PackageDescription: 2-Pin SOD, Body 1.6 x 2.69 mm; ComponentLink2Description: Datasheet; ComponentLink3Description: Package Specification
D?#2 = CMP-1744-00003-1: as D1 on sheet Sheet1; Min Operating Temperature: -55 degC; Length: 1.6 mm; ComponentLink3Description: Package Specification; Mount: Surface Mount; PackageReference: HSMX-C190; ComponentLink2Description: Datasheet; DatasheetVersion: Mar-12; Case Code (Metric): 1608; Pins: 2; Package Quantity: 5000; ComponentLink2URL: http://docs.avagotech.com/docs/AV02-0551EN; ComponentLink1Description: Manufacturer URL; RoHSCompliant: true; Packaging: Tape and Reel; PackageDescription: 2-Pin Surface Mount Device, Body 1.6 x 0.8 mm, Height 0.9 mm; REACH SVHC: No SVHC; ComponentLink3URL: http://www.fairchildsemi.com/dwg/MA/MA03D.pdf; Voltage Rating (DC): 50 V; Width: 0.8 mm; ComponentLink1URL: http://www.avagotech.com/; Max Operating Temperature: 155 degC; Case Code (Imperial): 0603; Height: 0.45 mm
R1 R2 = CMP-1012-00849-3: RES SMD 1M OHM 1% 1/10W 0603; Resistance: 1MR; Voltage Rating: 75V; Temperature Coefficient: 100ppm/°C; Power Rating: 100mW; REACH SVHC: No SVHC; Radiation Hardening: No; Features: Automotive AEC-Q200; Case Code (Metric): 1608; Resistance Tolerance: 1%; Case/Package: 0603; Termination: SMD/SMT; Max Operating Temperature: 155°C; Tolerance: 1%; Size Code: 0603; Case Code (Imperial): 0603; Min Operating Temperature: -55°C; Number of Pins: 2; Mount: Surface Mount; Package Quantity: 1; Military Standard: Not; Voltage Rating (DC): 75V; Depth: 0.8mm; Packaging: Tape and Reel; Width: 0.8mm; Number of Terminations: 2; Length: 1.6mm; Height: 0.022inch; RoHS Compliant: Yes; Resistor Type: Thick Film; Contact Plating: Tin; Lead Free: Lead Free; Series: ERJ; Construction: Rectangular; Max Power Dissipation: 100mW
R?#4 = CMP-2000-00564-2: Chip Resistor, 560 Ohm, +/- 1%, 0.1 W, -55 to 155 degC, 0603 (1608 Metric), RoHS, Tape and Reel; Output Current: 2 A; Max Supply Voltage: 5 V; Min Supply Voltage: 3 V; Output Voltage: 35 V; Case\Package: QFN; Outputs: 1; PackageDescription: 2-Pin Surface Mount Device, Body 1.6 x 0.85 mm; ComponentLink1Description: Manufacturer URL; ComponentLink1URL: http://www.panasonic.com/; ComponentLink2Description: Datasheet; Package Quantity: 1500; DatasheetVersion: Apr-15; Min Operating Temperature: -20 degC; PackageReference: 0603; RoHSCompliant: true; Packaging: Tape and Reel; ComponentLink2URL: http://industrial.panasonic.com/cdbs/www-data/pdf/RDA0000/AOA0000C86.pdf; Radiation Hardening: No; REACH SVHC: No SVHC; Mount: Surface Mount; Max Operating Temperature: 85 degC; Pins: 28
R?#5 = CMP-2100-03671-1: Chip Resistor, 1 KOhm, +/- 1%, 125 mW, -55 to 155 degC, 0805 (2012 Metric), RoHS, Tape and Reel; Manufacturer: Yageo; Temperature Coefficient: 100ppm/degreesC; Voltage Rating (DC): 150V; Max Power Dissipation: 125mW; Resistance: 1KOhm; Number of Pins: 2; Number of Terminations: 2; Datasheet URL: http://www.yageo.com/NewPortal/yageodocoutput?fileName=/pdf/R-Chip/PYu-RC_Group_51_RoHS_L_5.pdf; Length: 0.079inch; Package Description: 2-Pin Surface Mounted Device, Body 2 x 1.25 mm; Depth: 1.25mm; Height: 0.024inch; Military Standard: Not; Case/Package: 0805; Package Reference: 0805; RoHSCompliant: true; Lead Free: LeadFree; Packaging: TapeandReel; Package Quantity: 1; Datasheet Version: Rev. 5, 10/2016; Tolerance: 1%; Min Operating Temperature: -55degC; Voltage Rating: 150V; Composition: ThickFilm; Case Code (Imperial): 0805; Power Rating: 125mW; Width: 0.049inch; Case Code (Metric): 2012; Manufacturer URL: http://www.yageo.com/; Max Operating Temperature: 155degC; REACH SVHC: Unknown; Termination: SMD/SMT
SW1 = CMP-10038-000023-1: as SW?#1 on sheet Sheet1; Radiation Hardening: No; Throw Configuration: SPDT; Depth: 7.5mm; Case/Package: SMD/SMT; Package Quantity: 4000; Min Operating Temperature: -40°C; Length: 8.5mm; Current Rating: 300mA; Mount: Surface Mount; Voltage Rating (DC): 6V; RoHS Compliant: Yes; Orientation: Straight; Housing Material: Nylon; Contact Plating: Silver; Max Operating Temperature: 85°C; Packaging: Tape and Reel; Switch Travel: 2mm; Max Current Rating: 300mA; Contact Material: Copper Alloy; Series: JS; Termination: Gull Wing
U1#3 = CMP-0062-01788-4: as U1#1 on sheet Sheet1; Max Output Voltage: 3.3V; Length: 6.5mm; Termination: SMD/SMT; Width: 3.56mm; Min Supply Voltage: 4.5V; Max Output Current: 1A; Case/Package: SOT-223; Output Voltage: 3.3V; Current Rating: 1A; Packaging: Tape and Reel; Lead Free: Lead Free; Nominal Output Voltage: 3.3V; Height: 1.6mm; Series: -; Output Configuration: Positive; Radiation Hardening: No; Number of Regulators: 1; Package Quantity: 1000; REACH SVHC: No SVHC; Max Input Voltage: 7.5V; Max Operating Temperature: 125°C; Min Operating Temperature: -40°C; Output Current: 1A; Contact Plating: Tin; Number of Pins: 4; Mount: Surface Mount
U2#3 = CMP-04902-000018-1: as U2#2 on sheet Sheet1; Mount: Surface Mount; Packaging: Tape and Reel; Weight: 0.004998oz; Contact Plating: Gold; Independent Circuits: 4; Number of Pins: 16; Number of Bits: 4; Max Operating Temperature: 125°C; Radiation Hardening: No; Case/Package: SOIC; Number of Circuits: 1; Technology: CMOS; Min Operating Temperature: -55°C; Package Quantity: 1; Lead Free: Lead Free; RoHS Compliant: Yes; Logic Function: Latch; Series: 4000B
U?#5 = CMP-0859-00188-4: IC GATE OR 1CH 3-INP SOT23-6; Manufacturer: TEXAS INSTRUMENTS; Number Of Inputs: 3; Nominal Supply Current: 10-500uA; Number Of Circuits: 1; Max Supply Voltage: 5.5V; Standoff Height: 0mm; Propagation Delay: 4.5ns; Min Supply Voltage: 1.5V; Height: 1.45mm; Temperature Range High: +125°C; Device Class L3: Logic Gates; Device Class L2: Logic ICs; Lead Free: Yes; Temperature Range Low: -40°C; ComponentLink2URL: http://www.ti.com/lit/ds/symlink/sn74lvc1g332.pdf; Package: DBV0006A; ComponentLink2Description: Datasheet; Octopart: https://octopart.com/sn74lvc1g332dbvr-texas+instruments-464996; Category: IC; Automotive: No; Manufacturer Part Number: SN74LVC1G332DBVR; Ipc Land Pattern Name: SOT95P280X145-6; Logic Function Desc: OR; Ambient Temperature Range Low: -40°C; Temperature: -40°C to +125°C; Number Of Outputs: 1; Mouser Description: Logic Gates Sngl 3 Inpt + OR Gt; RoHS: TRUE; Ambient Temperature Range High: +125°C; Device Class L1: Integrated Circuits (ICs); Digikey Description: IC GATE OR 1CH 3-INP SOT23-6

## Sheet Telemetry.SchDoc
size A4; SheetNumber: 4; SheetTotal: 7
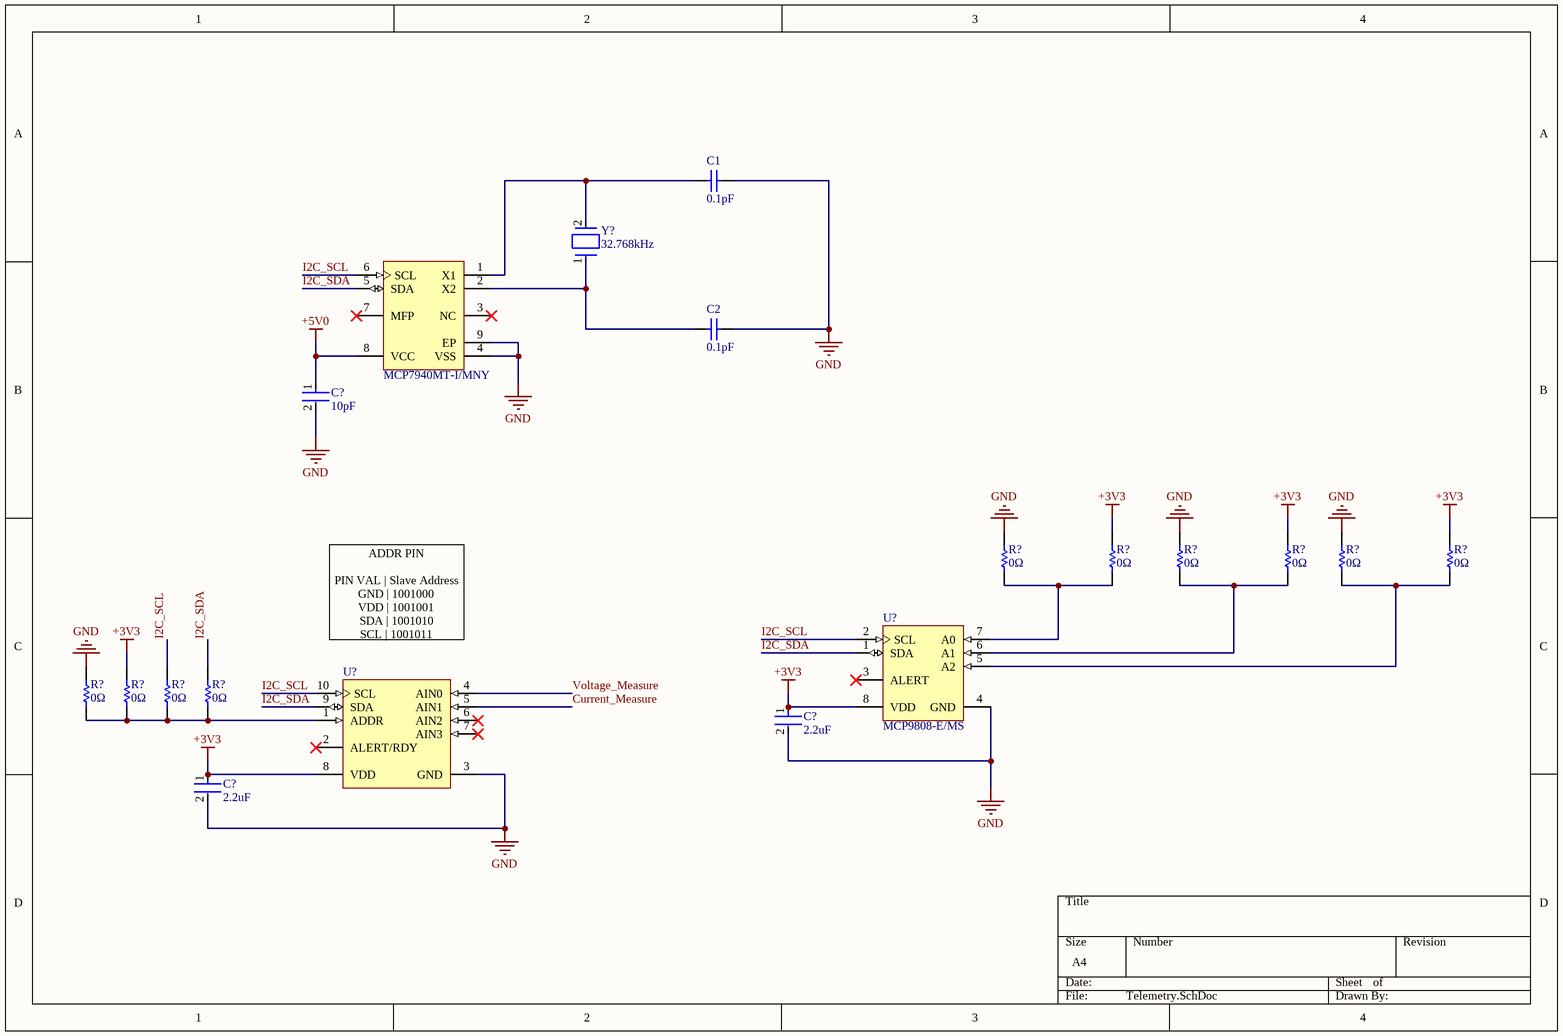
[diagram p3: Telemetry.SchDoc]

### Parts
(Parts that share a designator on the sheet are numbered #1, #2 ... from top to bottom, then left to right.)
?  MCP7940MT-I/MNY  [MCHP-TDFN-MNY8_V]
C1  0.1pF  [CAPC1508X91X25ML25T13]
C2  0.1pF  [CAPC1508X91X25ML25T13]
C?#6  10pF  [FP-C0603C-CF-MFG]
C?#7  2.2uF  [FP-GRM188-0_1-e0_2_0_5-MFG]
C?#8  2.2uF  [FP-GRM188-0_1-e0_2_0_5-MFG]
R?#6  0Ω  [RESC1005X40X25LL05T05]
R?#7  0Ω  [RESC1005X40X25LL05T05]
R?#8  0Ω  [RESC1005X40X25LL05T05]
R?#9  0Ω  [RESC1005X40X25LL05T05]
R?#10  0Ω  [RESC1005X40X25LL05T05]
R?#11  0Ω  [RESC1005X40X25LL05T05]
R?#12  0Ω  [RESC1005X40X25LL05T05]
R?#13  0Ω  [RESC1005X40X25LL05T05]
R?#14  0Ω  [RESC1005X40X25LL05T05]
R?#15  0Ω  [RESC1005X40X25LL05T05]
U?#6  MCP9808-E/MS  [MCHP-MSOP-MS8_L]
U?#7  (no value)  [TI-DGS10_M]
Y?#1  32.768kHz  [FP-ABS05W-MFG]

### Nets
+3V3: C?#7.1 C?#8.1 R?#7.2 R?#9.2 R?#11.2 R?#13.2 U?#6.8(VDD) U?#7.8(VDD)
+5V0: ?.8(VCC) C?#6.1
GND: ?.4(VSS) ?.9(EP) C1.2 C2.2 C?#6.2 C?#7.2 C?#8.2 R?#6.2 R?#8.2 R?#10.2 R?#12.2 U?#6.4(GND) U?#7.3(GND)
Current_Measure: U?#7.5(AIN1)
I2C_SCL: ?.6(SCL) R?#14.2 U?#6.2(SCL) U?#7.10(SCL)
I2C_SDA: ?.5(SDA) R?#15.2 U?#6.1(SDA) U?#7.9(SDA)
Voltage_Measure: U?#7.4(AIN0)
Net?_1: ?.1(X1) C1.1 Y?#1.2
Net?_2: ?.2(X2) C2.1 Y?#1.1
NetR?#6_1: R?#6.1 R?#7.1 U?#6.7(A0)
NetR?#8_1: R?#8.1 R?#9.1 U?#6.6(A1)
NetR?#10_1: R?#10.1 R?#11.1 U?#6.5(A2)
NetR?#12_1: R?#12.1 R?#13.1 R?#14.1 R?#15.1 U?#7.1(ADDR)

Not connected (* = marked no-connect by the designer): ? 3(NC)* 7(MFP)*; U?#6 3(ALERT)*; U?#7 2(ALERT/RDY)* 6(AIN2)* 7(AIN3)*

### Notes on the sheet
- ADDR PIN
  PIN VAL | Slave Address
  GND | 1001000
  VDD | 1001001
  SDA | 1001010
  SCL | 1001011

### Library data of the parts
? = CMP-0186-00324-1: as U7 on sheet Sheet1; ComponentLink2URL: http://ww1.microchip.com/downloads/en/DeviceDoc/22292A.pdf; ComponentLink3Description: Package Specification; Mounting Technology: Surface Mount; PackageVersion: C04-129C; ComponentLink4URL: http://www.microchip.com/MCP7940M; DatasheetVersion: Rev. A; PackageReference: TDFN-MNY8; PartNumber: MCP7940MT-I/MNY; ComponentLink4Description: Product URL; ComponentLink2Description: Datasheet; ComponentLink3URL: http://www.microchip.com/stellent/groups/techpub_sg/documents/packagingspec/en012702.pdf; PackageDescription: 8-Lead Plastic Dual Flat, 2 x 3 mm Body, 0.5 mm Pitch; ComponentLink1Description: Manufacturer URL; ComponentLink1URL: http://www.microchip.com
C1 C2 = CMP-2006-04670-1: Part Number: 06032U3R0BAT2A; Manufacturer: AVX Interconnect / Elco
C?#6 = CMP-2006-03343-2: CAP CER 10PF 50V NP0 0603; Manufacturer: KEMET; Manufacturer Part Number: C0603C100C5GACTU; Material: Ceramic; Temperature Coefficient: 30ppm/°C; Automotive Grade: Grade 1; Tolerance: 0.25 pF; Temperature Characteristic: C0G; Device Class L3: Ceramic Capacitors; Value: 10 pF; Device Class L1: Passive Components; Lead Free: Yes; RoHS: TRUE; Voltage Rating: 50 V; Automotive: Yes; Capacitance: 10 pF; Height: 0.87mm; Temperature Range Low: -55°C; Temperature Range High: +125°C; Mouser Description: Multilayer Ceramic Capacitors MLCC - SMD/SMT 50volts 10pF C0G 0.25%; Device Class L2: Capacitors; Digikey Description: CAP CER 10PF 50V NP0 0603; ComponentLink2Description: Datasheet; Package: C0603C-CF; ComponentLink2URL: https://api.kemet.com/component-edge/download/datasheet/C0603C100J5GACAUTO.pdf; Category: Cap; Octopart: https://octopart.com/c0603c100c5gactu-kemet-9138556; Temperature: -55°C to +125°C
C?#7 C?#8 = CMP-2006-02836-2: as C?#2 on sheet Power; Case Code (Metric): 1608; Height: 0.8mm; Packaging: Cut Tape; Voltage: 10V; Lead Free: Lead Free; Min Operating Temperature: -55°C; Voltage Rating (DC): 10V; Max Operating Temperature: 125°C; Voltage Rating: 10V; Dielectric: X7R; Depth: 0.8mm; Case Code (Imperial): 0603; Termination: SMD/SMT; Case/Package: 0603; Number of Pins: 2; REACH SVHC: No SVHC; Mount: Surface Mount; Width: 0.031inch; Material: Ceramic; Capacitance: 2.2uF; Package Quantity: 1; Weight: 7.1E-05oz; Length: 1.6mm; Thickness: 0.035inch; Tolerance: 10%
R?#6-R?#15 = CMP-2000-07451-1: Chip Resistor, 0 Ohm, 0.1 W, -55 to 155 degC, 0402 (1005 Metric), RoHS, Tape and Reel; Manufacturer: Panasonic; Voltage Rating (DC): 50V; Temperature Coefficient: 600ppm/��C; Max Power Dissipation: 100mW; Resistance: 0mOhm; Tolerance: 5%; Number of Terminations: 2; Mount: SurfaceMount; Height: 0.35mm; Packaging: TapeandReel; Contact Plating: Tin; Manufacturer URL: http://www.panasonic.com/; Composition: ThickFilm; Max Operating Temperature: 155degC; REACH SVHC: NoSVHC; Case/Package: 0402; Package Reference: 402; Depth: 0.5mm; Package Description: 2-Pin Surface Mount Device, Body 1 x 0.5 mm; Datasheet URL: https://industrial.panasonic.com/cdbs/www-data/pdf/RDA0000/AOA0000C301.pdf; RoHSCompliant: True; Case Code (Imperial): 0402; Military Standard: Not; Min Operating Temperature: -55degC; Power Rating: 100mW; Datasheet Version: 03/2015; Length: 1mm; Case Code (Metric): 1005; Termination: SMD/SMT; Mounting Technology: SurfaceMount; Voltage Rating: 50V; Width: 0.02inch; Package Quantity: 1; Lead Free: LeadFree; Radiation Hardening: No
U?#6 = CMP-0192-00344-1: as U6 on sheet Sheet1; ComponentLink3Description: Package Specification; ComponentLink4URL: http://www.microchip.com/MCP9808; PackageDescription: 8-Lead Plastic Micro Small Outline Package, 3 x 3 mm Body, 0.65 mm Pitch; ComponentLink2Description: Datasheet; PartNumber: MCP9808-E/MS; Mounting Technology: Surface Mount; ComponentLink4Description: Product URL; ComponentLink1Description: Manufacturer URL; ComponentLink2URL: http://ww1.microchip.com/downloads/en/DeviceDoc/25095A.pdf; ComponentLink3URL: http://www.microchip.com/stellent/groups/techpub_sg/documents/packagingspec/en012702.pdf; DatasheetVersion: Rev. A; ComponentLink1URL: http://www.microchip.com; PackageReference: MSOP-MS8; PackageVersion: C04-111C
U?#7 = CMP-0003-00378-2: 16-Bit ADC with Integrated Multiplexer, PGA, Comparator, Oscillator, and Reference, -40 to 125 degC, 10-pin SOP (DGS10), Green (RoHS & no Sb/Br); PartNumber: ADS1115IDGST; Manufacturer: Texas Instruments; Sample Rate (max)(SPS): 860; SubFamily: Precision ADC (<=10MSPS); Architecture: Delta-Sigma; Digital Supply(Min)(V): 2; Resolution(Bits): 16; Digital Supply(Max)(V): 5.5; INL(Max)(+/-LSB): 1; Interface: Serial I2C; # Input Channels: 4; Eco-Plan: Green (RoHS & no Sb/Br); PackageDescription: 10-Pin Plastic Small Outline, Body 3 x 3 mm, Pitch 0.5 mm; Mounting Technology: Surface Mount; PackageReference: DGS10; DatasheetVersion: SBAS444B; ComponentLink3Description: Package Specification; ComponentLink1Description: Manufacturer URL; ComponentLink3URL: http://www.ti.com/lit/ml/mpds035b/mpds035b.pdf; ComponentLink2URL: http://www.ti.com/general/docs/lit/getliterature.tsp?genericPartNumber=ADS1115&fileType=pdf; Analog Voltage AV/DD(Min)(V): 2; ComponentLink2Description: Datasheet; PackageVersion: 4073272/C, 02/2004; Analog Voltage AV/DD(Max)(V): 5.5; Code_JEDEC: MO-153; ComponentLink1URL: http://www.ti.com/
Y?#1 = CMP-27762-015607-1: Crystal 32.768kHz ±20ppm (Tol) 4pF 85kΩ 2-Pin SMD T/R; ESR (Equivalent Series Resistance): 85kR; Frequency Tolerance: 20ppm; Mount: Surface Mount; Load Capacitance: 4pF; Case/Package: SMD/SMT; Packaging: Cut Tape; Frequency: 32.768kHz; Series: ABS05W; Min Operating Temperature: -40°C; Max Operating Temperature: 125°C

## Sheet Microcontroller_Power.SchDoc
size A4; SheetNumber: 5; SheetTotal: 8
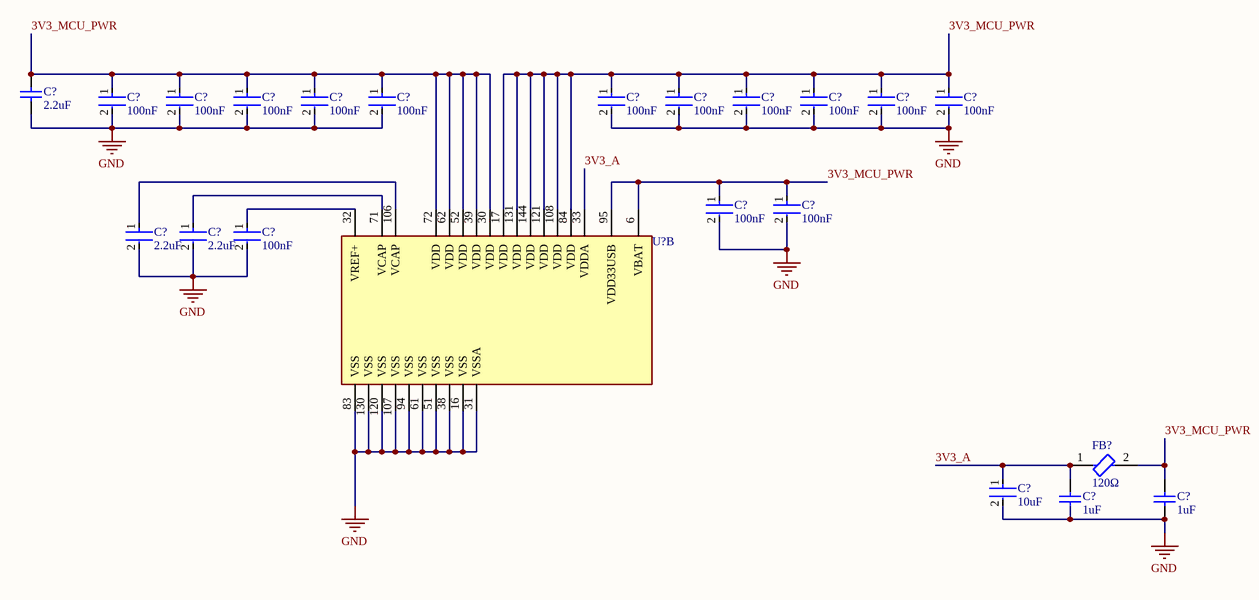
[diagram p4: Microcontroller_Power.SchDoc]

### Parts
(Parts that share a designator on the sheet are numbered #1, #2 ... from top to bottom, then left to right.)
C?#9  100nF  [FP-CGA3E-0_3-0_1-IPC_A]
C?#10  100nF  [FP-CGA3E-0_3-0_1-IPC_A]
C?#11  100nF  [FP-CGA3E-0_3-0_1-IPC_A]
C?#12  100nF  [FP-CGA3E-0_3-0_1-IPC_A]
C?#13  100nF  [FP-CGA3E-0_3-0_1-IPC_A]
C?#14  100nF  [FP-CGA3E-0_3-0_1-IPC_A]
C?#15  100nF  [FP-CGA3E-0_3-0_1-IPC_A]
C?#16  100nF  [FP-CGA3E-0_3-0_1-IPC_A]
C?#17  100nF  [FP-CGA3E-0_3-0_1-IPC_A]
C?#18  100nF  [FP-CGA3E-0_3-0_1-IPC_A]
C?#19  100nF  [FP-CGA3E-0_3-0_1-IPC_A]
C?#20  2.2uF  [CAPC2013X145X50ML20T25]
C?#21  100nF  [FP-CGA3E-0_3-0_1-IPC_A]
C?#22  100nF  [FP-CGA3E-0_3-0_1-IPC_A]
C?#23  2.2uF  [FP-GRM188-0_1-e0_2_0_5-MFG]
C?#24  2.2uF  [FP-GRM188-0_1-e0_2_0_5-MFG]
C?#25  100nF  [FP-CGA3E-0_3-0_1-IPC_A]
C?#26  10uF  [FP-GRM188-0_1-e0_2_0_55-IPC_A]
C?#27  1uF  [CAPC1608X87X35LL15T15]
C?#28  1uF  [CAPC1608X87X35LL15T15]
FB?  120Ω  [FP-BLM21-0_2-t0_85-e0_5-IPC_A]
U?#8  (no value)  [FP-LQFP144-1A-MFG]  (part B of 3)

### Nets
GND: C?#9.2 C?#10.2 C?#11.2 C?#12.2 C?#13.2 C?#14.2 C?#15.2 C?#16.2 C?#17.2 C?#18.2 C?#19.2 C?#20.1 C?#21.2 C?#22.2 C?#23.2 C?#24.2 C?#25.2 C?#26.2 C?#27.1 C?#28.1 U?#8.16(VSS) U?#8.31(VSSA) U?#8.38(VSS) U?#8.51(VSS) U?#8.61(VSS) U?#8.83(VSS) U?#8.94(VSS) U?#8.107(VSS) U?#8.120(VSS) U?#8.130(VSS)
3V3_A: C?#26.1 C?#27.2 FB?.1 U?#8.33(VDDA)
3V3_MCU_PWR: C?#9.1 C?#10.1 C?#11.1 C?#12.1 C?#13.1 C?#14.1 C?#15.1 C?#16.1 C?#17.1 C?#18.1 C?#19.1 C?#20.2 C?#21.1 C?#22.1 C?#28.2 FB?.2 U?#8.6(VBAT) U?#8.17(VDD) U?#8.30(VDD) U?#8.39(VDD) U?#8.52(VDD) U?#8.62(VDD) U?#8.72(VDD) U?#8.84(VDD) U?#8.95(VDD33USB) U?#8.108(VDD) U?#8.121(VDD) U?#8.131(VDD) U?#8.144(VDD)
NetC?#23_1: C?#23.1 U?#8.106(VCAP)
NetC?#24_1: C?#24.1 U?#8.71(VCAP)
NetC?#25_1: C?#25.1 U?#8.32(VREF+)

### Library data of the parts
C?#9-C?#19 C?#21 C?#22 C?#25 = CMP-2000-07546-2: as C?#1 on sheet Connectors; Weight: 7.1E-05oz; Composition: Ceramic; Max Operating Temperature: 125°C; Termination: SMD/SMT; Dielectric: X7R; Length: 1.6mm; Package Quantity: 1; REACH SVHC: No SVHC; Lead Free: Lead Free; Case Code (Metric): 1608; Min Operating Temperature: -55°C; Packaging: Tape and Reel; Tolerance: 10%; Voltage Rating: 50V; Case Code (Imperial): 0603; Capacitance: 100nF; Case/Package: 0603; Voltage Rating (DC): 50V; Depth: 0.8mm; Radiation Hardening: No; Ratings: AEC-Q200; Mount: Surface Mount; Voltage: 50V; Thickness: 0.035inch; Width: 0.8mm; Height: 0.8mm
C?#20 = CMP-1036-04819-2: Part Number: C0805C225K9PACTU; Manufacturer: Kemet
C?#23 C?#24 = CMP-2006-02836-2: as C?#2 on sheet Power; Case Code (Metric): 1608; Height: 0.8mm; Packaging: Cut Tape; Voltage: 10V; Lead Free: Lead Free; Min Operating Temperature: -55°C; Voltage Rating (DC): 10V; Max Operating Temperature: 125°C; Voltage Rating: 10V; Dielectric: X7R; Depth: 0.8mm; Case Code (Imperial): 0603; Termination: SMD/SMT; Case/Package: 0603; Number of Pins: 2; REACH SVHC: No SVHC; Mount: Surface Mount; Width: 0.031inch; Material: Ceramic; Capacitance: 2.2uF; Package Quantity: 1; Weight: 7.1E-05oz; Length: 1.6mm; Thickness: 0.035inch; Tolerance: 10%
C?#26 = CMP-2006-02792-2: Chip Multilayer Ceramic Capacitors for General Purpose, 0603, 10uF, X5R, 15%, 20%, 6.3V; Packaging: Tape and Reel; Voltage Rating (DC): 6.3V; Width: 0.031inch; Termination: SMD/SMT; Dielectric: X5R; Package Quantity: 4000; Voltage Rating: 6.3V; Capacitance: 10uF; Case/Package: 0603; Min Operating Temperature: -55°C; Voltage: 6.3V; Length: 1.6mm; Thickness: 0.035inch; Lead Free: Lead Free; Depth: 0.8mm; Case Code (Imperial): 0603; Max Operating Temperature: 85°C; Material: Ceramic; Height: 0.8mm; Tolerance: 20%; Mount: Surface Mount; REACH SVHC: No SVHC; Radiation Hardening: No; Case Code (Metric): 1608
C?#27 C?#28 = CMP-2006-03713-1: Part Number: C0603C105K3RACTU; Manufacturer: Kemet
FB? = CMP-0686-00716-3: FERRITE BEAD 120 OHM 0805 1LN; Number of Lines: 1; DC Resistance-Max: 100mR; Material: Steel; Max DC Current: 200mA; Shielding: Unshielded; Test Frequency: 100MHz; Impedance: 120R; Current Rating: 800mA; Max Current Rating: 1A; Resistance: 150mR; Tolerance: 25%; Width: 1.25mm; Number of Circuits: 1; Military Standard: Not; Height: 0.85mm; Series: BLM21A; Min Operating Temperature: -55°C; DC Resistance (DCR): 100mR; Termination: SMD/SMT; Core Material: Ferrite; REACH SVHC: No SVHC; Radiation Hardening: No; Max Operating Temperature: 125°C; Number of Pins: 2; Case/Package: 0805; Case Code (Imperial): 0805; Frequency: 100MHz; Depth: 1.25mm; Length: 2mm; DC Current: 200mA; Lead Free: Lead Free; Case Code (Metric): 2012; Package Quantity: 1; Packaging: Tape and Reel
U?#8 = CMP-12105-000009-1: LQFP 144 20X20X1.4 2; Manufacturer: STMicroelectronics; Manufacturer Part Number: STM32H753ZIT6; Number Of Pwm Channels: 24; Number Of I/Os: 114; Number Of Cores: 1; Min Supply Voltage: 1.62V; Interface: I2C,SPI,UART,USART,CAN,USB,LIN,IrDA,Ethernet,I2S,SMBus,Other; Standoff Height: 0.05mm; Number Of I2C Channels: 4; Max Junction Temp: +125°C; Memory Type: FLASH; Ram Size: 1MBytes; Number Of Spi Channels: 6; Core Architecture: ARM Cortex-M7; Number Of Uart Channels: 9; Memory Size: 2MBytes; Number Of Adc Channels: 36; Frequency: 480MHz; Data Bus Width: 32bits; Max Supply Voltage: 3.6V; Number Of Usb Channels: 2; Number Of A/D Converters: 3; Number Of Timers/Counters: 20; Temperature Range High: +125°C; Automotive: No; Mouser Description: MCU 32-Bit STM32 ARM Cortex M7 RISC 2MB Flash 1.8V/2.5V/3.3V 144-Pin LQFP Tray; Device Class L3: Microcontrollers; Height: 1.6mm; Octopart: https://octopart.com/stm32h753zit6-stmicroelectronics-87879771; Device Class L2: Embedded Processors and Controllers; Lead Free: Yes; Category: IC; ComponentLink2URL: https://www.st.com/resource/en/datasheet/stm32h753zi.pdf; Ambient Temperature Range High: +85°C; Number Of Ethernet Channels: 1; Device Class L1: Integrated Circuits (ICs); Ambient Temperature Range Low: -40°C; Package: LQFP144-1A; Temperature Range Low: -40°C; Digikey Description: LQFP 144 20X20X1.4 2; ComponentLink2Description: Datasheet; Temperature: -40°C to +125°C; RoHS: TRUE